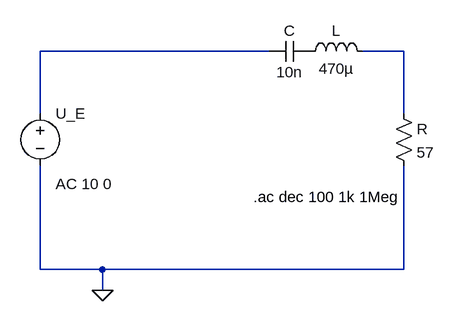
[diagram p0: schematic labor3.asc]
labor3.asc, the LTspice schematic file:
Version 4
SHEET 1 880 680
WIRE 144 112 -208 112
WIRE 352 112 288 112
WIRE -208 208 -208 112
WIRE 352 208 352 112
WIRE -208 448 -208 288
WIRE -112 448 -208 448
WIRE 352 448 352 288
WIRE 352 448 -112 448
WIRE -112 480 -112 448
FLAG -112 480 0
SYMBOL voltage -208 192 R0
WINDOW 123 24 124 Left 2
WINDOW 39 0 0 Left 0
SYMATTR Value2 AC 10 0
SYMATTR InstName U_E
SYMATTR Value ""
SYMBOL cap 208 96 R90
WINDOW 0 0 32 VBottom 2
WINDOW 3 32 32 VTop 2
SYMATTR InstName C
SYMATTR Value 10n
SYMBOL ind 192 128 R270
WINDOW 0 32 56 VTop 2
WINDOW 3 5 56 VBottom 2
SYMATTR InstName L
SYMATTR Value 470µ
SYMBOL res 336 192 R0
SYMATTR InstName R
SYMATTR Value 57
TEXT 120 336 Left 2 !.ac dec 100 1k 1Meg

The netlist it stands for:
* labor3.asc
V§U_E N001 0 AC 10 0
C P001 N001 10n
L P001 N002 470µ
R N002 0 57
.ac dec 100 1k 1Meg
.backanno
.end